# EAGLE schematic board_1.5(FixMosfetGND_OUT12V)v (EAGLE 7.7.0)
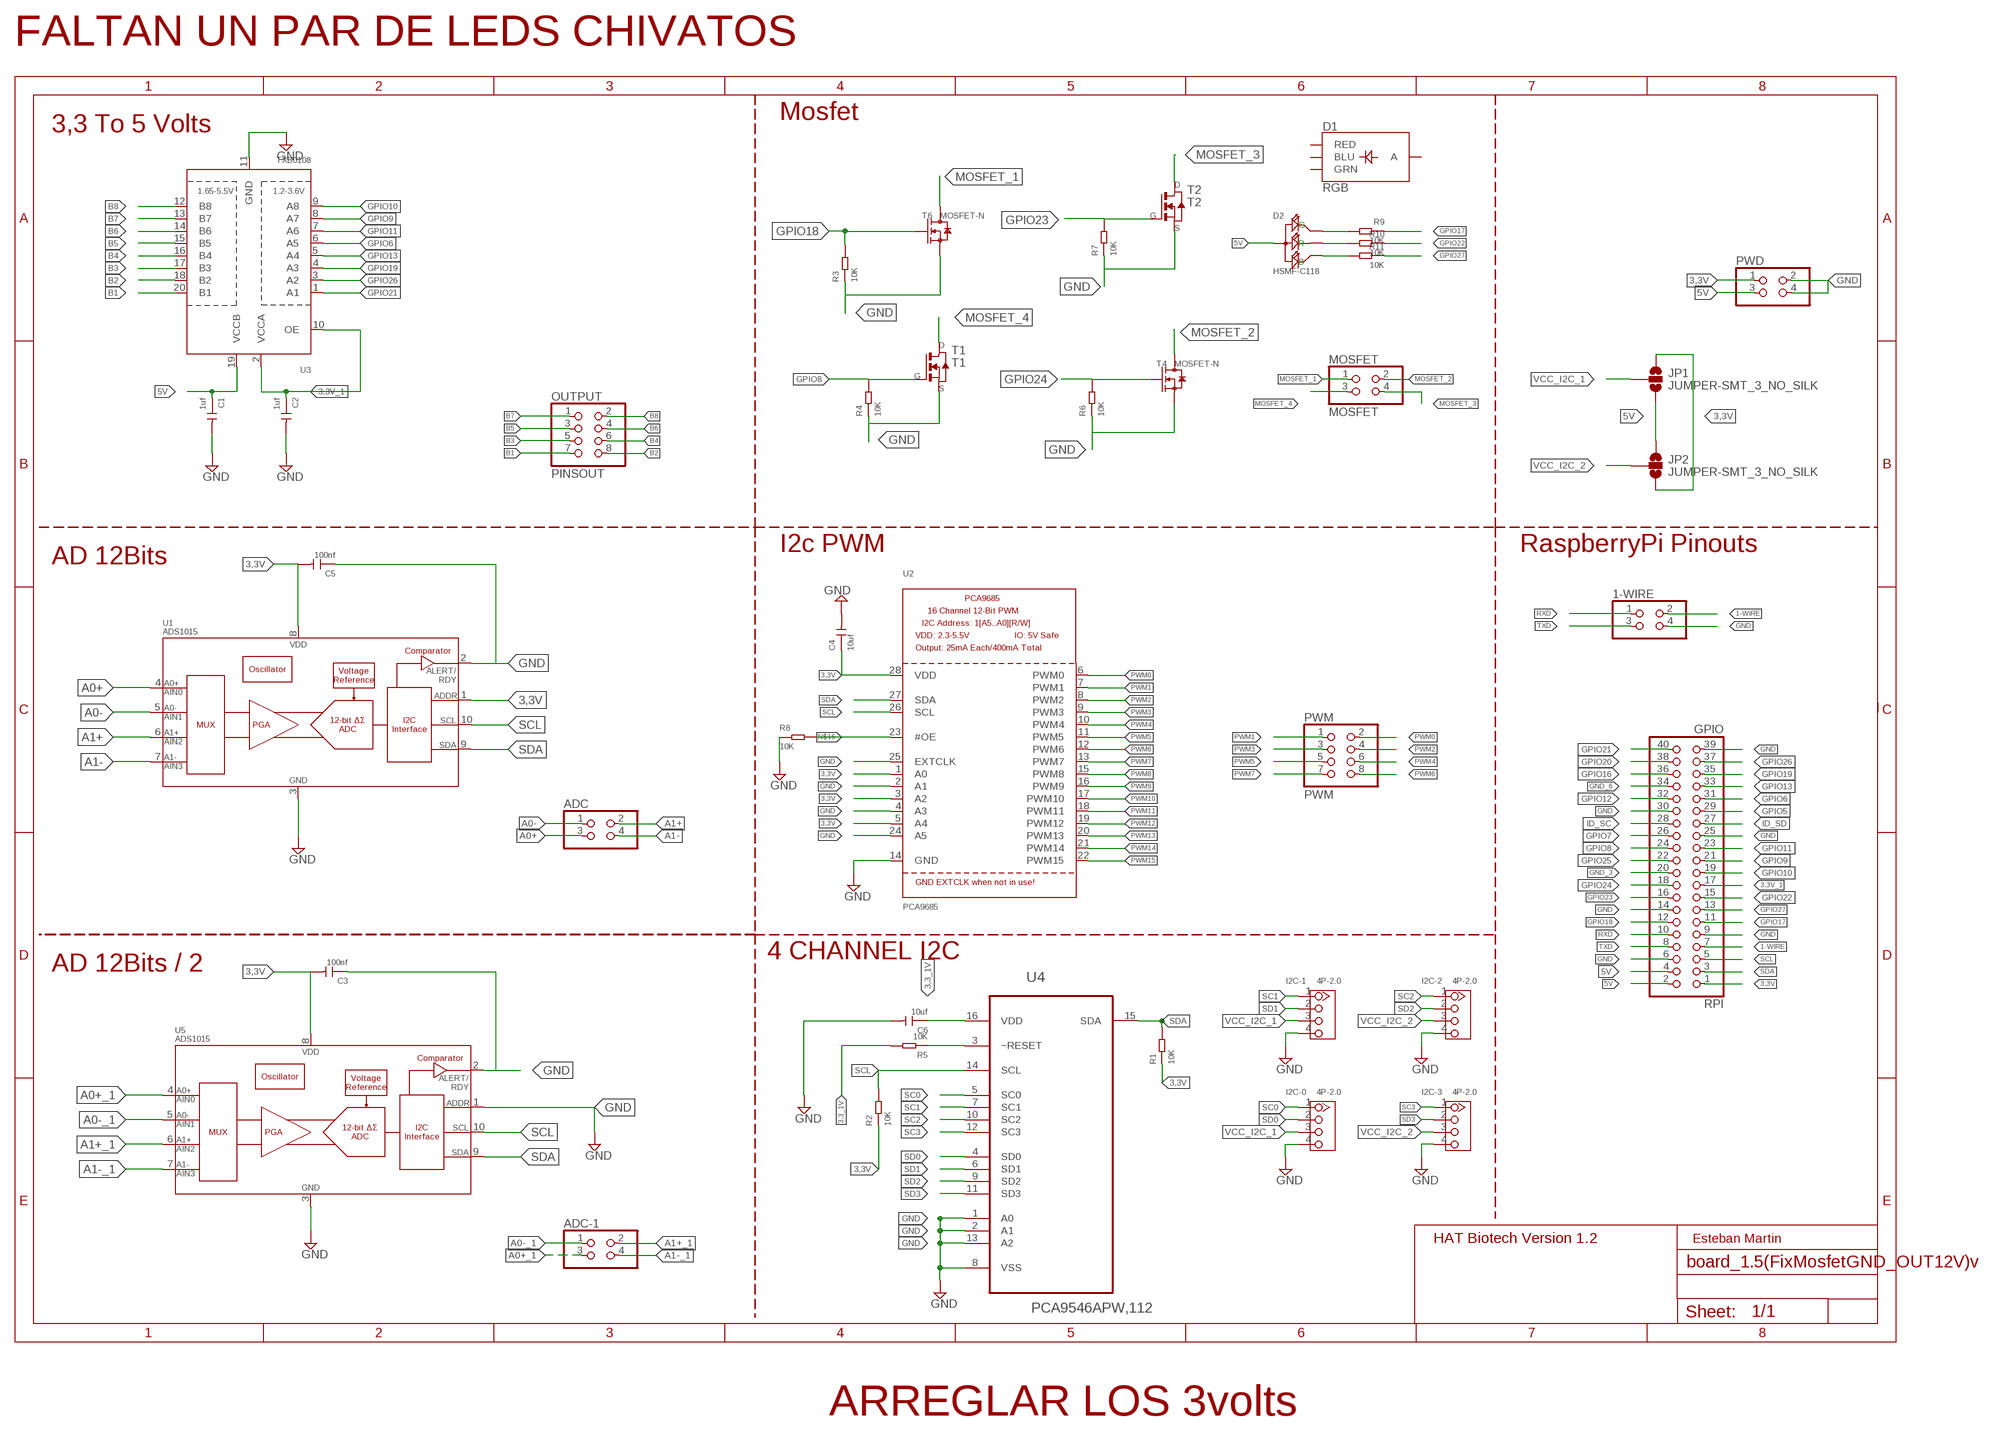
[diagram p0: schematic, sheet 1]

## Parts
1-WIRE  PINHD-2X2  [2X02]
ADC  PINHD-2X2  [2X02]
ADC-1  PINHD-2X2  [2X02]
C1  1uf  CERAMIC-1UF-25V-10%-X7R(0805)  [C0805]
C2  1uf  CERAMIC-1UF-25V-10%-X7R(0805)  [C0805]
C3  100nf  CERAMIC-100NF-50V-10%-X7R(0805)  [C0805]
C4  10uf  CERAMIC-1UF-25V-10%-X7R(0805)  [C0805]
C5  100nf  CERAMIC-100NF-50V-10%-X7R(0805)  [C0805]
C6  10uf  CERAMIC-1UF-25V-10%-X7R(0805)  [C0805]
D1  RGB  LED-RGB-CAPLCC  [P-LCC-4-3]
D2  HSMF-C118  SMD-LED-RGB(4P-1210)  [LED4-SMD-1210]
I2C-0  4P-2.0  GROVE-CONNECTOR-DIP(4P-2.0)  [HW4-2.0]
I2C-1  4P-2.0  GROVE-CONNECTOR-DIP(4P-2.0)  [HW4-2.0]
I2C-2  4P-2.0  GROVE-CONNECTOR-DIP(4P-2.0)  [HW4-2.0]
I2C-3  4P-2.0  GROVE-CONNECTOR-DIP(4P-2.0)  [HW4-2.0]
JP1  JUMPER-SMT_3_NO_SILK  [SMT-JUMPER_3_NO_SILK]
JP2  JUMPER-SMT_3_NO_SILK  [SMT-JUMPER_3_NO_SILK]
MOSFET  MOSFET  PINHD-2X2  [2X02]
OUTPUT  PINSOUT  PINHD-2X4  [2X04]
PWD  PINHD-2X2  [2X02]
PWM  PWM  PINHD-2X4  [2X04]
R1  10K  SMD-RES-10K-1%-1/8W(0805)  [R0805]
R2  10K  SMD-RES-10K-1%-1/8W(0805)  [R0805]
R3  10K  SMD-RES-10K-1%-1/8W(0805)  [R0805]
R4  10K  SMD-RES-10K-1%-1/8W(0805)  [R0805]
R5  10K  SMD-RES-10K-1%-1/8W(0805)  [R0805]
R6  10K  SMD-RES-10K-1%-1/8W(0805)  [R0805]
R7  10K  SMD-RES-10K-1%-1/8W(0805)  [R0805]
R8  10K  SMD-RES-10K-1%-1/8W(0805)  [R0805]
R9  10K  SMD-RES-10K-1%-1/8W(0805)  [R0805]
R10  10K  SMD-RES-10K-1%-1/8W(0805)  [R0805]
R11  10K  SMD-RES-10K-1%-1/8W(0805)  [R0805]
RPI  GPIO  PINHD-2X20  [2X20]
T1  T1  NMOSFETTO252  [TO252]
T2  T2  NMOSFETTO252  [TO252]
T4  MOSFET-N  [SOT-23]
T6  MOSFET-N  [SOT-23]
U1  ADS1015  [MSOP10]
U2  PCA9685  [TSSOP28]
U3  TXB0108  TXB0108PWR  [TSSOP20]
U4  PCA9546APW,112  [SOP65P640X110-16N]
U5  ADS1015  [MSOP10]

## Nets
1-WIRE: 1-WIRE.2 RPI.7
3,3_1V: C6.1 R5.2 U4.16(VDD)
3,3V: C3.2 C4.1 C5.2 JP1.1 JP2.3 PWD.1 R1.1 R2.1 RPI.1 U1.1(ADDR) U1.8(VDD) U2.1(A0) U2.3(A2) U2.5(A4) U2.28(VDD) U5.8(VDD)
3,3V_1: C2.1 RPI.17 U3.2(VCCA) U3.10(OE)
5V: C1.1 D2.1(+) JP1.3 JP2.1 PWD.3 RPI.2 RPI.4 U3.19(VCCB)
A0+: ADC.3 U1.4(AIN0)
A0+_1: ADC-1.3 U5.4(AIN0)
A0-: ADC.1 U1.5(AIN1)
A0-_1: ADC-1.1 U5.5(AIN1)
A1+: ADC.2 U1.6(AIN2)
A1+_1: ADC-1.2 U5.6(AIN2)
A1-: ADC.4 U1.7(AIN3)
A1-_1: ADC-1.4 U5.7(AIN3)
B1: OUTPUT.7 U3.20(B1)
B2: OUTPUT.8 U3.18(B2)
B3: OUTPUT.5 U3.17(B3)
B4: OUTPUT.6 U3.16(B4)
B5: OUTPUT.3 U3.15(B5)
B6: OUTPUT.4 U3.14(B6)
B7: OUTPUT.1 U3.13(B7)
B8: OUTPUT.2 U3.12(B8)
GND: 1-WIRE.4 C1.2 C2.2 C3.1 C4.2 C5.1 C6.2 I2C-0.4 I2C-1.4 I2C-2.4 I2C-3.4 PWD.2 PWD.4 R3.1 R4.1 R6.1 R7.1 R8.1 RPI.6 RPI.9 RPI.14 RPI.25 RPI.30 RPI.39 T1.2(S) T2.2(S) T4.2(S) T6.2(S) U1.2(ALERT/RDY) U1.3(VSS) U2.2(A1) U2.4(A3) U2.14(GND) U2.24(A5) U2.25(EXTCLK) U3.11(GND) U4.1(A0) U4.2(A1) U4.8(VSS) U4.13(A2) U5.1(ADDR) U5.2(ALERT/RDY) U5.3(VSS)
GND_3: RPI.20
GND_6: RPI.34
GPIO5: RPI.29
GPIO6: RPI.31 U3.6(A5)
GPIO7: RPI.26
GPIO8: R4.2 RPI.24 T1.1(G)
GPIO9: RPI.21 U3.8(A7)
GPIO10: RPI.19 U3.9(A8)
GPIO11: RPI.23 U3.7(A6)
GPIO12: RPI.32
GPIO13: RPI.33 U3.5(A4)
GPIO16: RPI.36
GPIO17: R9.1 RPI.11
GPIO18: R3.2 RPI.12 T6.1(G)
GPIO19: RPI.35 U3.4(A3)
GPIO20: RPI.38
GPIO21: RPI.40 U3.1(A1)
GPIO22: R10.1 RPI.15
GPIO23: R7.2 RPI.16 T2.1(G)
GPIO24: R6.2 RPI.18 T4.1(G)
GPIO25: RPI.22
GPIO26: RPI.37 U3.3(A2)
GPIO27: R11.1 RPI.13
ID_SC: RPI.28
ID_SD: RPI.27
MOSFET_1: MOSFET.1 T6.3(D)
MOSFET_2: MOSFET.2 T4.3(D)
MOSFET_3: MOSFET.4 T2.3(D)
MOSFET_4: MOSFET.3 T1.3(D)
N$3: D2.3(G) R9.2
N$4: D2.2(R) R10.2
N$5: D2.4(B) R11.2
N$7: R5.1 U4.3(~RESET)
N$16: R8.2 U2.23(#OE)
PWM0: PWM.2 U2.6(PWM0)
PWM1: PWM.1 U2.7(PWM1)
PWM2: PWM.4 U2.8(PWM2)
PWM3: PWM.3 U2.9(PWM3)
PWM4: PWM.6 U2.10(PWM4)
PWM5: PWM.5 U2.11(PWM5)
PWM6: PWM.8 U2.12(PWM6)
PWM7: PWM.7 U2.13(PWM7)
PWM8: U2.15(PWM8)
PWM9: U2.16(PWM9)
PWM10: U2.17(PWM10)
PWM11: U2.18(PWM11)
PWM12: U2.19(PWM12)
PWM13: U2.20(PWM13)
PWM14: U2.21(PWM14)
PWM15: U2.22(PWM15)
RXD: 1-WIRE.1 RPI.10
SC0: I2C-0.1 U4.5(SC0)
SC1: I2C-1.1 U4.7(SC1)
SC2: I2C-2.1 U4.10(SC2)
SC3: I2C-3.1 U4.12(SC3)
SCL: R2.2 RPI.5 U1.10(SCL) U2.26(SCL) U4.14(SCL) U5.10(SCL)
SD0: I2C-0.2 U4.4(SD0)
SD1: I2C-1.2 U4.6(SD1)
SD2: I2C-2.2 U4.9(SD2)
SD3: I2C-3.2 U4.11(SD3)
SDA: R1.2 RPI.3 U1.9(SDA) U2.27(SDA) U4.15(SDA) U5.9(SDA)
TXD: 1-WIRE.3 RPI.8
VCC_I2C_1: I2C-0.3 I2C-1.3 JP1.2
VCC_I2C_2: I2C-2.3 I2C-3.3 JP2.2
Unconnected: D1.1(RED) D1.2(GRN) D1.3(BLU) D1.4(A)

## Notes on the sheet
- FALTAN UN PAR DE LEDS CHIVATOS
- Mosfet
- 3,3 To 5 Volts
- I2c PWM | RaspberryPi Pinouts
- AD 12Bits
- 4 CHANNEL I2C
- AD 12Bits / 2
- HAT Biotech Version 1.2 | Esteban Martin
- ARREGLAR LOS 3volts

## Library data of the parts
1-WIRE ADC ADC-1 MOSFET PWD = pinhead:PINHD-2X2: PIN HEADER
C1 C2 = Seeed-OPL-Capacitor:CERAMIC-1UF-25V-10%-X7R(0805): 302010179; MPN: CC0805KKX7R8BB105
C3 C5 = Seeed-OPL-Capacitor:CERAMIC-100NF-50V-10%-X7R(0805): 302010165; MPN: CC0805KRX7R9BB104
C4 C6 = Seeed-OPL-Capacitor:CERAMIC-1UF-25V-10%-X7R(0805): 302010179; MPN: CC0805KKX7R8BB105; VALUE: 1uf
D1 = SparkFun-LED:LED-RGB-CA: LED-RGB Diffused Common Anode Packages: LED RGB-THRU P-LCC-4-3 LED-TRICOLOR-SMD SparkFun Products: RGB Diffused Common Anode- Diffuse <[https://www.sparkfun.com/products/10821]> RGB Diffused Common Anode - Clear <[https://www.sparkfun.com/products/10820]> Qduino Mini <[https://www.sparkfun.com/products/13614]> Triple Output LED RGB - SMD <https://www.sparkfun.com/products/7844>; PROD_ID: DIO-12986
D2 = Seeed-OPL-Diode:SMD-LED-RGB(4P-1210): 304090035; MPN: HSMF-C118
I2C-0 I2C-1-I2C-3 = Seeed-OPL-Connector:GROVE-CONNECTOR-DIP(4P-2.0): 320110033
JP1 JP2 = SparkFun-Jumpers:JUMPER-SMT_3_NO: Normally open jumper This jumper has three pads in close proximity to each other. Apply solder to close the connection(s).
OUTPUT PWM = adafruit:PINHD-2X4: PIN HEADER
R1-R11 = Seeed-OPL-Resistor:SMD-RES-10K-1%-1/8W(0805): 301010361; MPN: RC0805FR-0710KL
RPI = adafruit:PINHD-2X20: PIN HEADER
T1 T2 = fab_2:NMOSFET: MOS FET
T4 T6 = Seeed-OPL-Transistor:MOSFET-N
U1 U5 = SparkFun-IC-Conversion:ADS1015: ADS1015 12-BIT ADC 12-Bit Del-Sig ADC Four single-ended inputs or two differential inputs Internal PGA I2C interface 2.0-5.5V SparkFun Products SparkFun Block for Intel Edison - ADC <https://www.sparkfun.com/products/13770> (DEV-13770); PROD_ID: IC-12270
U2 = adafruit:PCA9685: PCA9685 - 16 Channel 12-Bit I2C PWM Controller 5.0V tolerant 16 channel, 12-bit I2C PWM controller with 25mA per output (max. 400mA total) Digikey: 568-5931-1-ND
U3 = adafruit:TXB0108PWR: 8-Bit Bi-Directional Level Shifter 1.2V-3.6V (VCCA) to 1.65V-5.5V (VCCB) bi-directional level shifter with auto direction sensing. Max data rate - VCCA 1.8V: 20Mbps (50ns), VCCA 3.3V: 100Mbps (10ns) Digikey: 296-21527-1-ND
U4 = NXP_By_element14_Batch_1:PCA9546APW,112: 4-channel I2C-bus switch with reset; MPN: PCA9546APW,112; OC_FARNELL: 1831208; OC_NEWARK: 70R6610; PACKAGE: TSSOP-16; SUPPLIER: NXP